# EAGLE design Lab_1 (EAGLE 9.0.0)
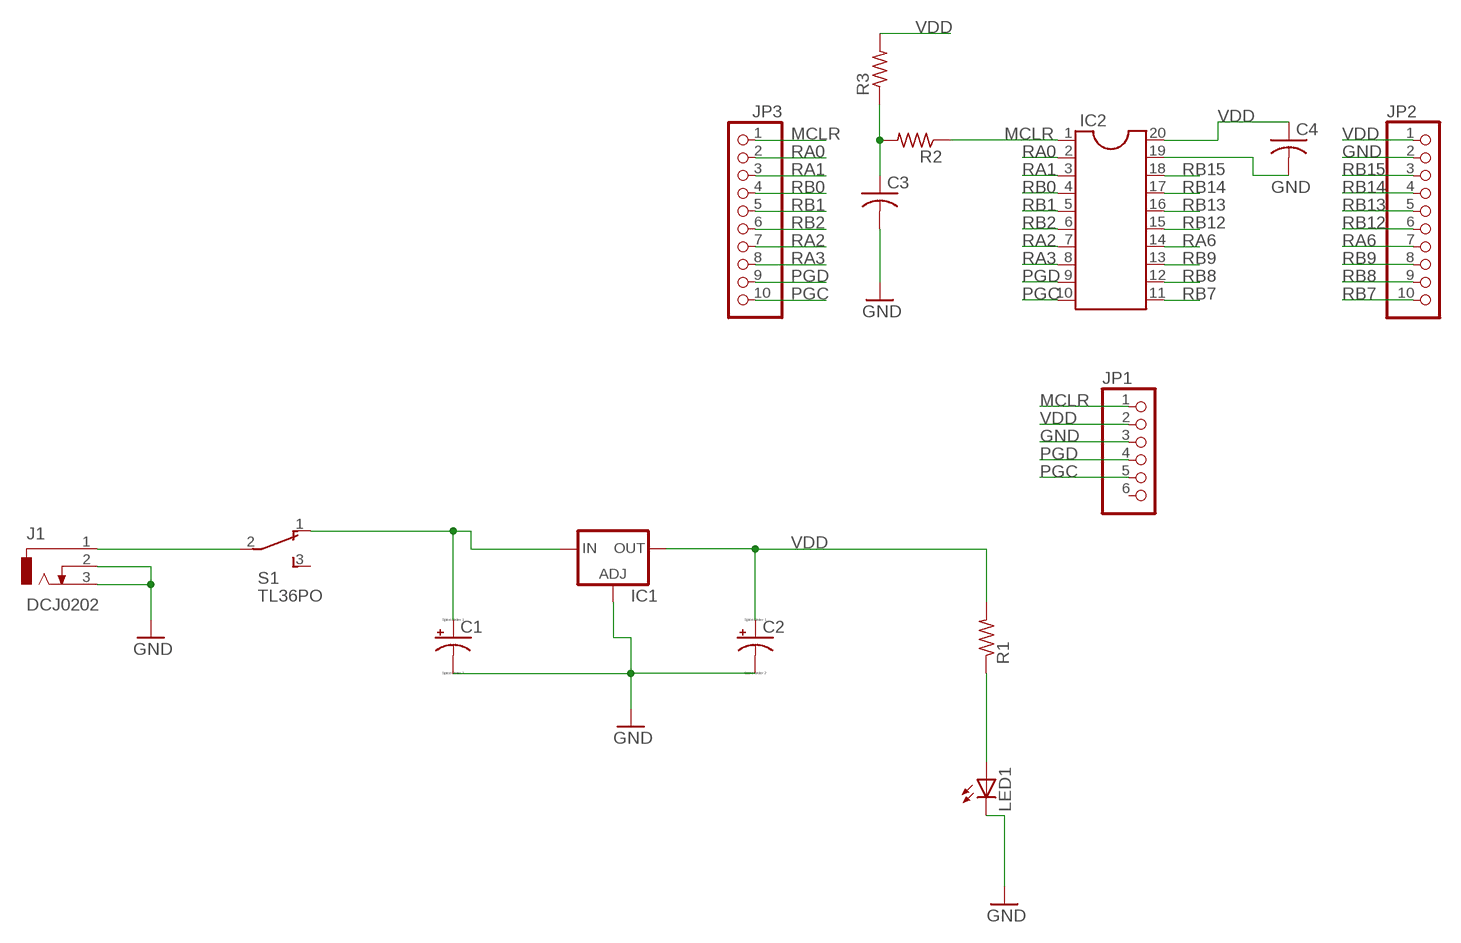
[diagram p0: schematic, sheet 1]

## Parts
C1  CPOL-USE2.5-5  [E2,5-5]
C2  CPOL-USE2.5-5  [E2,5-5]
C3  C-US025-024X044  [C025-024X044]
C4  C-US025-024X044  [C025-024X044]
IC1  LM317TS  [317TS]
IC2  DIL20S  [SOCKET-20]
J1  DCJ0202  [DCJ0202]
JP1  PINHD-1X6  [1X06]
JP2  PINHD-1X10  [1X10]
JP3  PINHD-1X10  [1X10]
LED1  LED3MM  [LED3MM]
R1  R-US_0204/7  [0204/7]
R2  R-US_0204/7  [0204/7]
R3  R-US_0204/7  [0204/7]
S1  TL36PO  [TL3XPO]

## Nets
GND [Power]: C1.- C2.- C3.2 C4.2 IC1.1(ADJ) IC2.19 J1.2 J1.3 JP1.3 JP2.2 LED1.K(C)
MCLR: IC2.1 JP1.1 JP3.1 R2.1
N$1 [Power]: J1.1 S1.2(P)
N$2 [Power]: C1.+ IC1.3(IN) S1.1(O)
N$3: C3.1 R2.2 R3.1
N$6: LED1.A R1.1
PGC: IC2.10 JP1.5 JP3.10
PGD: IC2.9 JP1.4 JP3.9
RA0: IC2.2 JP3.2
RA1: IC2.3 JP3.3
RA2: IC2.7 JP3.7
RA3: IC2.8 JP3.8
RA6: IC2.14 JP2.7
RB0: IC2.4 JP3.4
RB1: IC2.5 JP3.5
RB2: IC2.6 JP3.6
RB7: IC2.11 JP2.10
RB8: IC2.12 JP2.9
RB9: IC2.13 JP2.8
RB12: IC2.15 JP2.6
RB13: IC2.16 JP2.5
RB14: IC2.17 JP2.4
RB15: IC2.18 JP2.3
VDD [Power]: C2.+ C4.1 IC1.2(OUT) IC2.20 JP1.2 JP2.1 R1.2 R3.2
Unconnected: JP1.6 S1.3(S)

## Library data of the parts
C1 C2 = resistor:CPOL-US: POLARIZED CAPACITOR, American symbol
C3 C4 = resistor:C-US: CAPACITOR, American symbol
IC1 = v-reg:LM317TS: VOLTAGE REGULATOR
IC2 = ic-package:DIL20: Dual In Line / Socket
J1 = con-jack:DCJ0202: DC POWER JACK Source: DCJ0202.pdf; OC_FARNELL: unknown; OC_NEWARK: unknown
JP1 = pinhead:PINHD-1X6: PIN HEADER
JP2 JP3 = pinhead:PINHD-1X10: PIN HEADER
LED1 = led:LED: LED OSRAM: - CHIPLED LG R971, LG N971, LY N971, LG Q971, LY Q971, LO R971, LY R971 LH N974, LH R974 LS Q976, LO Q976, LY Q976 LO Q996 - Hyper CHIPLED LW Q18S LB Q993, LB Q99A, LB R99A - SideLED LS A670, LO A670, LY A670, LG A670, LP A670 LB A673, LV A673, LT A673, LW A673 LH A674 LY A675 LS A676, LA A676, LO A676, LY A676, LW A676 LS A679, LY A679, LG A679 - Hyper Micro SIDELED® LS Y876, LA Y876, LO Y876, LY Y876 LT Y87S - SmartLED LW L88C, LW L88S LB L89C, LB L89S, LG L890 LS L89K, LO L89K, LY L89K LS L896, LA L896, LO L896, LY L896 - TOPLED LS T670, LO T670, LY T670, LG T670, LP T670 LSG T670, LSP T670, LSY T670, LOP T670, LYG T670 LG T671, LOG T671, LSG T671 LB T673, LV T673, LT T673, LW T673 LH T674 LS T676, LA T676, LO T676, LY T676, LB T676, LH T676, LSB T676, LW T676 LB T67C, LV T67C, LT T67C, LS T67K, LO T67K, LY T67K, LW E67C LS E67B, LA E67B, LO E67B, LY E67B, LB E67C, LV E67C, LT E67C LW T67C LS T679, LY T679, LG T679 LS T770, LO T770, LY T770, LG T770, LP T770 LB T773, LV T773, LT T773, LW T773 LH T774 LS E675, LA E675, LY E675, LS T675 LS T776, LA T776, LO T776, LY T776, LB T776 LHGB T686 LT T68C, LB T68C - Hyper Mini TOPLED® LB M676 - Mini TOPLED Santana® LG M470 LS M47K, LO M47K, LY M47K Source: http://www.osram.convergy.de LUXEON: - LUMILED® LXK2-PW12-R00, LXK2-PW12-S00, LXK2-PW14-U00, LXK2-PW14-V00 LXK2-PM12-R00, LXK2-PM12-S00, LXK2-PM14-U00 LXK2-PE12-Q00, LXK2-PE12-R00, LXK2-PE12-S00, LXK2-PE14-T00, LXK2-PE14-U00 LXK2-PB12-K00, LXK2-PB12-L00, LXK2-PB12-M00, LXK2-PB14-N00, LXK2-PB14-P00, LXK2-PB14-Q00 LXK2-PR12-L00, LXK2-PR12-M00, LXK2-PR14-Q00, LXK2-PR14-R00 LXK2-PD12-Q00, LXK2-PD12-R00, LXK2-PD12-S00 LXK2-PH12-R00, LXK2-PH12-S00 LXK2-PL12-P00, LXK2-PL12-Q00, LXK2-PL12-R00 Source: www.luxeon.com KINGBRIGHT: KA-3528ASYC Source: www.kingbright.com
R1-R3 = resistor:R-US_: RESISTOR, American symbol
S1 = switch:TL36PO: TINY SWITCH ON - ON Source: http://www2.produktinfo.conrad.com/datenblaetter/700000-724999/705152-da-01-de-Subminiaturschalter_TL_36YO.pdf

## Net classes
1 Power: width 0.305 mm

## Board
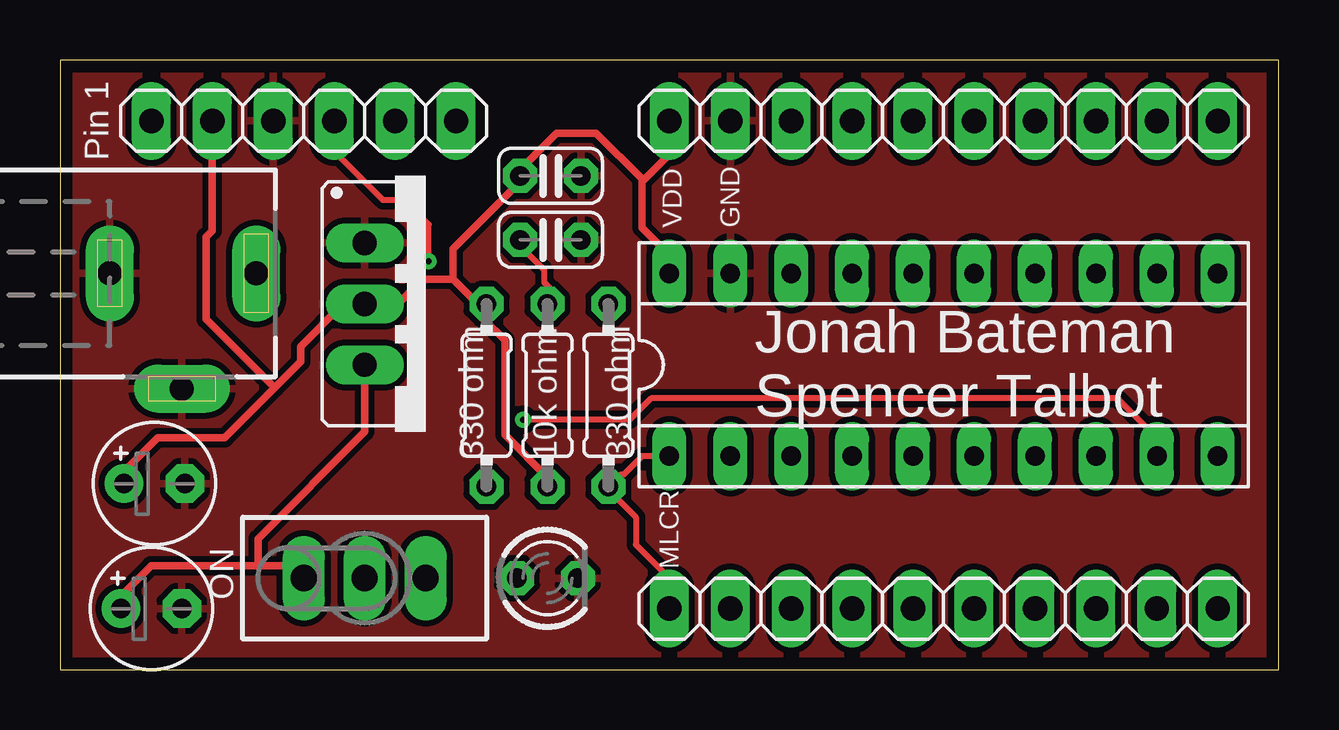
[diagram p1: board, top side]
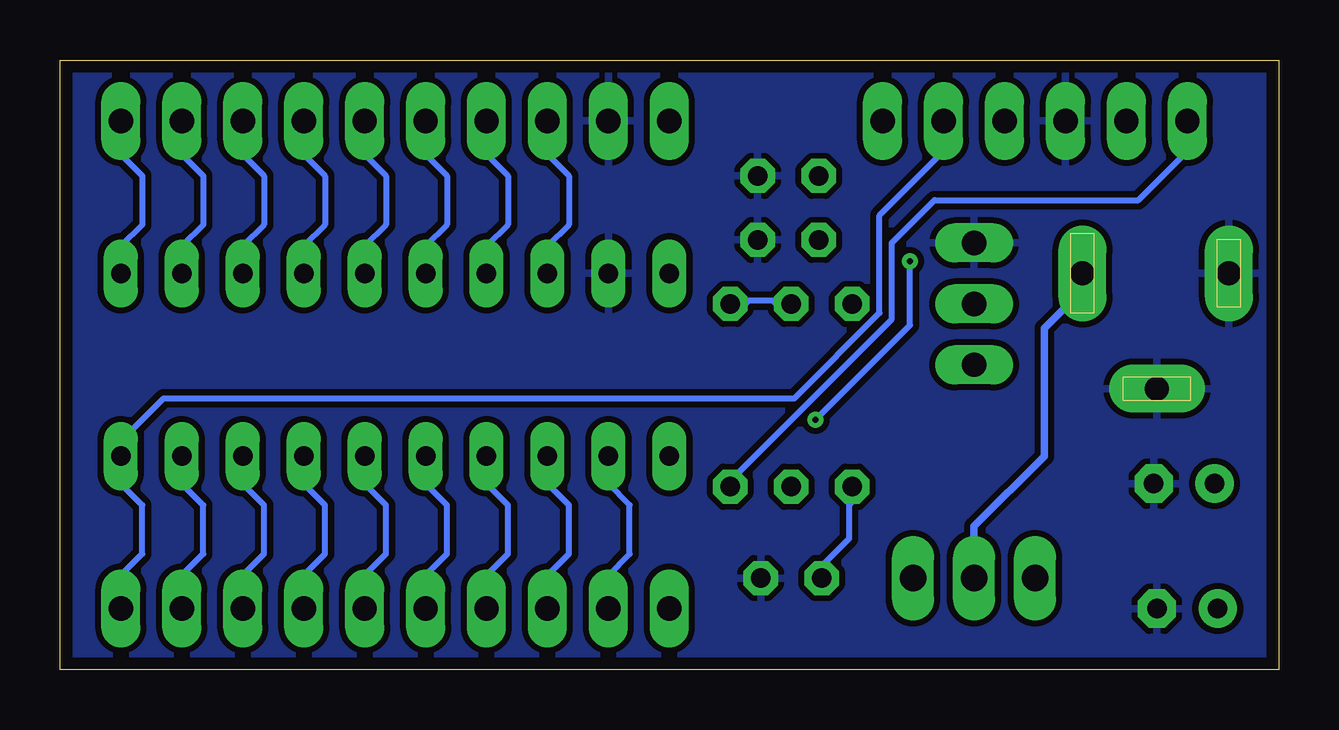
[diagram p2: board, bottom side, seen from below]

Size 50.8 x 25.4 mm. Coordinates in mm from the lower left corner, seen from the top.
Outline: 0,0 50.8,0 50.8,25.4 0,25.4 0,0
Copper layers (1*16): Top 0.035mm / dielectric 1.5mm / Bottom 0.035mm
Design rules "4pcb": minimum track width 10mil, minimum drill 10mil, track to track 10mil, track to pad 10mil, pad to pad 10mil, via to via 10mil, smd to smd 8mil, copper to edge 20mil, drill to drill 10mil, minimum pad ring 12mil, minimum via ring 8mil, stop-mask expansion 4mil, vias tented up to drill 0mil, thermal gap 10mil

### Footprints (pad centres in the part's own frame; a part is rotated, then mirrored left to right if it is on the bottom)
E2,5-5 = drill 0.813 pad 1.6: + -1.27,0 | drill 0.813 pad 1.6 octagon: - 1.27,0
C025-024X044 = drill 0.813 octagon: 1 -1.27,0; 2 1.27,0
317TS = drill 1.016 long: 1 -2.54,-2.54; 2 0,-2.54; 3 2.54,-2.54
SOCKET-20 = drill 0.813 long: 1 -11.43,-3.81; 2 -8.89,-3.81; 3 -6.35,-3.81; 4 -3.81,-3.81; 5 -1.27,-3.81; 6 1.27,-3.81; 7 3.81,-3.81; 8 6.35,-3.81; 9 8.89,-3.81; 10 11.43,-3.81; 11 11.43,3.81; 12 8.89,3.81; 13 6.35,3.81; 14 3.81,3.81; 15 1.27,3.81; 16 -1.27,3.81; 17 -3.81,3.81; 18 -6.35,3.81; 19 -8.89,3.81; 20 -11.43,3.81
DCJ0202 = drill 1 pad 2 long: 1 0,3.1; 2 4.8,0; 3 0,-3
1X06 = drill 1.016 long: 1 -6.35,0; 2 -3.81,0; 3 -1.27,0; 4 1.27,0; 5 3.81,0; 6 6.35,0
1X10 = drill 1.016 long: 1 -11.43,0; 2 -8.89,0; 3 -6.35,0; 4 -3.81,0; 5 -1.27,0; 6 1.27,0; 7 3.81,0; 8 6.35,0; 9 8.89,0; 10 11.43,0
LED3MM = drill 0.813 octagon: A -1.27,0; K 1.27,0
0204/7 = drill 0.813 octagon: 1 -3.81,0; 2 3.81,0
TL3XPO = drill 1.1 pad 1.422 long: 1 -2.54,0; 2 0,0; 3 2.54,0

### Placement (x,y rotation side)
C1  3.81,2.54 0 top
C2  3.94,7.75 0 top
C3  20.45,17.91 0 top
C4  20.45,20.57 0 top
IC1  15.24,15.24 270 top
IC2  36.83,12.7 0 top
J1  5.08,16.51 270 top
JP1  10.16,22.86 0 top
JP2  36.83,22.86 0 top
JP3  36.83,2.54 0 top
LED1  20.32,3.81 0 top
R1  17.78,11.43 90 top
R2  22.86,11.43 90 top
R3  20.32,11.43 270 top
S1  12.7,3.81 0 top

### Tracks (layer width: path | path; a pad name or v marks a point on that pad's centre or on a via)
GND
  pour Top: 0,0 50.8,0 50.8,25.4 0,25.4
  pour Bottom: 0,0 50.8,0 50.8,25.4 0,25.4
MCLR
  Top 0.254: IC2.1 24.26,8.89 23.5,8.13 23.37,8.13 R2.1 22.99,7.62 22.99,7.37 24,6.35 24,5.21 25.4,3.81 JP3.1
  Bottom 0.254: JP1.1 3.81,21.59 5.84,19.56 14.35,19.56 16.13,17.78 16.13,14.61 22.86,7.87 R2.1
N$1
  Bottom 0.305: S1.2 12.7,5.97 9.78,8.89 9.78,14.22 8.26,15.75 8.26,16.51 J1.1
N$2
  Top 0.305: C1.+ 2.54,3.05 3.81,4.32 8.26,4.32 | 8.26,4.32 9.65,4.32 S1.1 | IC1.3 12.7,9.91 8.26,5.46 8.26,4.32
N$3
  Top 0.254: C3.1 19.18,17.65 20.19,16.64 20.19,16.13 20.45,15.88 20.45,15.37 R3.1
  Bottom 0.254: R2.2 22.23,15.24 22.1,15.37 21.08,15.37 20.95,15.24 R3.1
N$6
  Bottom 0.254: LED1.A 19.05,4.32 17.91,5.46 17.91,6.86 17.78,6.99 R1.1
PGC
  Bottom 0.254: JP3.10 48.26,3.94 47.37,4.83 47.37,6.86 48.26,7.75 IC2.10 48.26,9.53 46.48,11.3 20.19,11.3 16.64,14.86 16.64,18.92 13.97,21.59 JP1.5
PGD  (via drill 0.25)
  Top 0.254: JP1.4 11.43,21.59 13.46,19.56 14.35,19.56 15.37,18.54 v15.37,17.02 | v19.3,10.41 23.75,10.41 24.64,11.3 44.07,11.3 45.72,9.65 IC2.9
  Bottom 0.254: IC2.9 45.72,7.75 44.83,6.86 44.83,4.83 45.72,3.94 JP3.9 | v15.37,17.02 15.37,14.35 v19.3,10.41
RA0
  Bottom 0.254: IC2.2 27.94,7.75 27.05,6.86 27.05,4.83 27.94,3.94 JP3.2
RA1
  Bottom 0.254: IC2.3 30.48,7.75 29.59,6.86 29.59,4.83 30.48,3.94 JP3.3
RA2
  Bottom 0.254: IC2.7 40.64,7.75 39.75,6.86 39.75,4.83 40.64,3.94 JP3.7
RA3
  Bottom 0.254: IC2.8 43.18,7.75 42.29,6.86 42.29,4.83 43.18,3.94 JP3.8
RA6
  Bottom 0.254: IC2.14 40.64,17.65 39.75,18.54 39.75,20.57 40.64,21.46 JP2.7
RB0
  Bottom 0.254: IC2.4 33.02,7.75 32.13,6.86 32.13,4.83 33.02,3.94 JP3.4
RB1
  Bottom 0.254: IC2.5 35.56,7.75 34.67,6.86 34.67,4.83 35.56,3.94 JP3.5
RB2
  Bottom 0.254: IC2.6 38.1,7.75 37.21,6.86 37.21,4.83 38.1,3.94 JP3.6
RB7
  Bottom 0.254: IC2.11 48.26,17.65 47.37,18.54 47.37,20.57 48.26,21.46 JP2.10
RB8
  Bottom 0.254: IC2.12 45.72,17.65 44.83,18.54 44.83,20.57 45.72,21.46 JP2.9
RB9
  Bottom 0.254: IC2.13 43.18,17.65 42.29,18.54 42.29,20.57 43.18,21.46 JP2.8
RB12
  Bottom 0.254: IC2.15 38.1,17.65 37.21,18.54 37.21,20.57 38.1,21.46 JP2.6
RB13
  Bottom 0.254: IC2.16 35.56,17.65 34.67,18.54 34.67,20.57 35.56,21.46 JP2.5
RB14
  Bottom 0.254: IC2.17 33.02,17.65 32.13,18.54 32.13,20.57 33.02,21.46 JP2.4
RB15
  Bottom 0.254: IC2.18 30.48,17.65 29.59,18.54 29.59,20.57 30.48,21.46 JP2.3
VDD
  Top 0.305: IC2.20 25.4,17.27 24.26,18.41 24.26,20.32 | 24.26,20.32 25.4,21.46 JP2.1 | 16.38,16.26 17.4,15.24 R1.2 17.65,15.11 17.65,14.61 18.54,13.72 18.54,9.78 20.32,8 R3.2 | 16.38,16.26 15.11,16.26 14.1,15.24 IC1.2 11.81,15.24 10.03,13.46 10.03,12.83 8.95,11.75 | 16.38,16.26 16.38,17.53 19.18,20.32 C4.1 19.18,20.83 20.7,22.35 22.35,22.35 24.26,20.45 24.26,20.32 | C2.+ 2.67,8.26 4.06,9.65 6.86,9.65 8.95,11.75 | JP1.2 6.35,18.29 6.1,18.03 6.1,14.61 8.95,11.75

### Text on the board
tPlace: Pin 1 | VDD | GND | Jonah Bateman / Spencer Talbot | 330 ohm / / 10k ohm / / 330 ohm | MLCR | ON